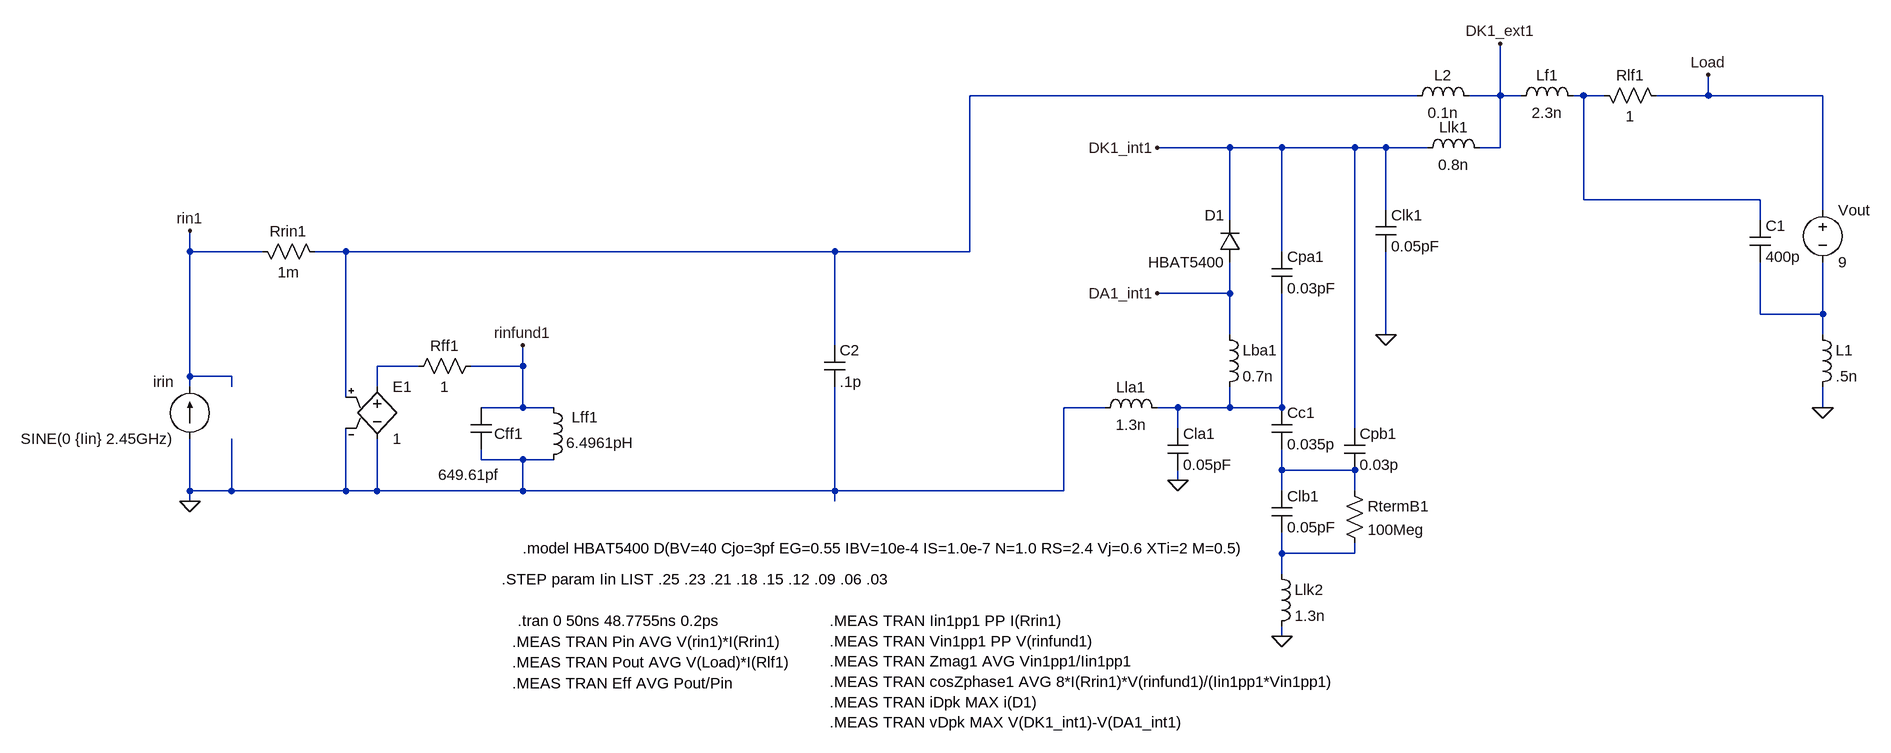
[diagram p0: schematic ResonantRectifier3_HBAT540B_v1.asc]
ResonantRectifier3_HBAT540B_v1.asc, the LTspice schematic file:
Version 4
SHEET 1 2084 796
WIRE 1328 -256 640 -256
WIRE 1456 -256 1456 -336
WIRE 1456 -256 1408 -256
WIRE 1488 -256 1456 -256
WIRE 1584 -256 1568 -256
WIRE 1616 -256 1584 -256
WIRE 1776 -256 1776 -288
WIRE 1776 -256 1696 -256
WIRE 1952 -256 1776 -256
WIRE 1040 -176 928 -176
WIRE 1120 -176 1040 -176
WIRE 1232 -176 1120 -176
WIRE 1280 -176 1232 -176
WIRE 1344 -176 1280 -176
WIRE 1456 -176 1456 -256
WIRE 1456 -176 1424 -176
WIRE 1584 -96 1584 -256
WIRE 1856 -96 1584 -96
WIRE 1280 -80 1280 -176
WIRE 1952 -80 1952 -256
WIRE 1040 -64 1040 -176
WIRE 1856 -64 1856 -96
WIRE -560 -16 -560 -48
WIRE -448 -16 -560 -16
WIRE -320 -16 -368 -16
WIRE 432 -16 -320 -16
WIRE 640 -16 640 -256
WIRE 640 -16 432 -16
WIRE 1120 -16 1120 -176
WIRE 1040 48 1040 0
WIRE 1040 48 928 48
WIRE 1856 80 1856 0
WIRE 1952 80 1952 0
WIRE 1952 80 1856 80
WIRE 1040 112 1040 48
WIRE 1280 112 1280 -16
WIRE 1952 112 1952 80
WIRE 432 128 432 -16
WIRE -208 160 -272 160
WIRE -48 160 -48 128
WIRE -48 160 -128 160
WIRE -560 176 -560 -16
WIRE -496 176 -560 176
WIRE -560 192 -560 176
WIRE -496 192 -496 176
WIRE -272 192 -272 160
WIRE -320 208 -320 -16
WIRE -48 224 -48 160
WIRE -48 224 -112 224
WIRE 0 224 -48 224
WIRE 848 224 784 224
WIRE 960 224 928 224
WIRE 1040 224 1040 192
WIRE 1040 224 960 224
WIRE 1120 224 1120 48
WIRE 1120 224 1040 224
WIRE 1952 224 1952 192
WIRE 960 256 960 224
WIRE 1232 256 1232 -176
WIRE -112 304 -112 288
WIRE -48 304 -112 304
WIRE 0 304 -48 304
WIRE 1120 320 1120 288
WIRE 1232 320 1120 320
WIRE 960 336 960 320
WIRE -560 352 -560 272
WIRE -496 352 -496 272
WIRE -496 352 -560 352
WIRE -320 352 -320 256
WIRE -320 352 -496 352
WIRE -272 352 -272 272
WIRE -272 352 -320 352
WIRE -48 352 -48 304
WIRE -48 352 -272 352
WIRE 432 352 432 192
WIRE 432 352 -48 352
WIRE 784 352 784 224
WIRE 784 352 432 352
WIRE 1120 352 1120 320
WIRE 1232 352 1232 320
WIRE -560 368 -560 352
WIRE 432 368 432 352
WIRE 1120 448 1120 416
WIRE 1232 448 1232 432
WIRE 1232 448 1120 448
WIRE 1120 480 1120 448
WIRE 1120 576 1120 560
FLAG -560 368 0
FLAG 928 -176 DK1_int1
FLAG -560 -48 rin1
FLAG 1776 -288 Load
FLAG -48 128 rinfund1
FLAG 1280 112 0
FLAG 960 336 0
FLAG 1120 576 0
FLAG 928 48 DA1_int1
FLAG 1456 -336 DK1_ext1
FLAG 1952 224 0
SYMBOL cap 1104 -16 R0
SYMATTR InstName Cpa1
SYMATTR Value 0.03pF
SYMBOL cap 1264 -80 R0
SYMATTR InstName Clk1
SYMATTR Value 0.05pF
SYMBOL ind 1472 -240 R270
WINDOW 0 32 56 VTop 2
WINDOW 3 5 56 VBottom 2
SYMATTR InstName Lf1
SYMATTR Value 2.3n
SYMBOL res 1600 -272 M90
WINDOW 0 0 56 VBottom 2
WINDOW 3 32 56 VTop 2
SYMATTR InstName Rlf1
SYMATTR Value 1
SYMBOL cap -128 224 R0
WINDOW 0 36 40 Left 2
WINDOW 3 -50 103 Left 2
SYMATTR InstName Cff1
SYMATTR Value 649.61pf
SYMBOL ind -16 208 R0
WINDOW 0 43 31 Left 2
WINDOW 3 35 70 Left 2
SYMATTR InstName Lff1
SYMATTR Value 6.4961pH
SYMBOL e -272 176 R0
SYMATTR InstName E1
SYMATTR Value 1
SYMBOL current -560 272 R180
WINDOW 0 24 88 Left 2
WINDOW 3 24 0 Left 2
WINDOW 123 0 0 Left 2
WINDOW 39 0 0 Left 2
SYMATTR InstName irin
SYMATTR Value SINE(0 {Iin} 2.45GHz)
SYMBOL res -112 144 R90
WINDOW 0 0 56 VBottom 2
WINDOW 3 32 56 VTop 2
SYMATTR InstName Rff1
SYMATTR Value 1
SYMBOL voltage 1952 -96 R0
WINDOW 123 0 0 Left 2
WINDOW 39 0 0 Left 2
SYMATTR InstName Vout
SYMATTR Value 9
SYMBOL res -464 -32 M90
WINDOW 0 0 56 VBottom 2
WINDOW 3 32 56 VTop 2
SYMATTR InstName Rrin1
SYMATTR Value 1m
SYMBOL diode 1056 0 R180
WINDOW 0 24 72 Left 2
WINDOW 3 24 0 Left 2
SYMATTR InstName D1
SYMATTR Value HBAT5400
SYMBOL ind 1024 96 R0
SYMATTR InstName Lba1
SYMATTR Value 0.7n
SYMBOL ind 1328 -160 R270
WINDOW 0 32 56 VTop 2
WINDOW 3 5 56 VBottom 2
SYMATTR InstName Llk1
SYMATTR Value 0.8n
SYMBOL cap 944 256 R0
SYMATTR InstName Cla1
SYMATTR Value 0.05pF
SYMBOL cap 1104 224 R0
SYMATTR InstName Cc1
SYMATTR Value 0.035p
SYMBOL cap 1104 352 R0
SYMATTR InstName Clb1
SYMATTR Value 0.05pF
SYMBOL cap 1216 256 R0
SYMATTR InstName Cpb1
SYMATTR Value 0.03p
SYMBOL ind 832 240 R270
WINDOW 0 32 56 VTop 2
WINDOW 3 5 56 VBottom 2
SYMATTR InstName Lla1
SYMATTR Value 1.3n
SYMBOL res 1216 336 R0
SYMATTR InstName RtermB1
SYMATTR Value 100Meg
SYMBOL ind 1104 464 R0
SYMATTR InstName Llk2
SYMATTR Value 1.3n
SYMBOL cap 1840 -64 R0
SYMATTR InstName C1
SYMATTR Value 400p
SYMBOL ind 1936 96 R0
SYMATTR InstName L1
SYMATTR Value .5n
SYMBOL ind 1312 -240 R270
WINDOW 0 32 56 VTop 2
WINDOW 3 5 56 VBottom 2
SYMATTR InstName L2
SYMATTR Value 0.1n
SYMBOL cap 416 128 R0
SYMATTR InstName C2
SYMATTR Value .1p
TEXT -48 440 Left 2 !.model HBAT5400 D(BV=40 Cjo=3pf EG=0.55 IBV=10e-4 IS=1.0e-7 N=1.0 RS=2.4 Vj=0.6 XTi=2 M=0.5)
TEXT -56 552 Left 2 !.tran 0 50ns 48.7755ns 0.2ps
TEXT -64 584 Left 2 !.MEAS TRAN Pin AVG V(rin1)*I(Rrin1)
TEXT -64 616 Left 2 !.MEAS TRAN Pout AVG V(Load)*I(Rlf1)
TEXT -64 648 Left 2 !.MEAS TRAN Eff AVG Pout/Pin
TEXT 424 552 Left 2 !.MEAS TRAN Iin1pp1 PP I(Rrin1)\n.MEAS TRAN Vin1pp1 PP V(rinfund1)\n.MEAS TRAN Zmag1 AVG Vin1pp1/Iin1pp1\n.MEAS TRAN cosZphase1 AVG 8*I(Rrin1)*V(rinfund1)/(Iin1pp1*Vin1pp1)\n.MEAS TRAN iDpk MAX i(D1)\n.MEAS TRAN vDpk MAX V(DK1_int1)-V(DA1_int1)
TEXT -80 488 Left 2 !.STEP param Iin LIST .25 .23 .21 .18 .15 .12 .09 .06 .03

The netlist it stands for:
* ResonantRectifier3_HBAT540B_v1.asc
Cpa1 DK1_int1 N005 0.03pF
Clk1 DK1_int1 0 0.05pF
Lf1 DK1_ext1 N002 2.3n
Rlf1 N002 Load 1
Cff1 rinfund1 0 649.61pf
Lff1 rinfund1 0 6.4961pH
E1 N004 0 N001 0 1
irin 0 rin1 SINE(0 {Iin} 2.45GHz)
Rff1 rinfund1 N004 1
Vout Load N003 9
Rrin1 rin1 N001 1m
D1 DA1_int1 DK1_int1 HBAT5400
Lba1 DA1_int1 N005 0.7n
Llk1 DK1_int1 DK1_ext1 0.8n
Cla1 N005 0 0.05pF
Cc1 N005 N006 0.035p
Clb1 N006 N007 0.05pF
Cpb1 DK1_int1 N006 0.03p
Lla1 0 N005 1.3n
RtermB1 N006 N007 100Meg
Llk2 N007 0 1.3n
C1 N002 N003 400p
L1 N003 0 .5n
L2 N001 DK1_ext1 0.1n
C2 N001 0 .1p
.model D D
.lib standard.dio
.model HBAT5400 D(BV=40 Cjo=3pf EG=0.55 IBV=10e-4 IS=1.0e-7 N=1.0 RS=2.4 Vj=0.6 XTi=2 M=0.5)
.tran 0 50ns 48.7755ns 0.2ps
.MEAS TRAN Pin AVG V(rin1)*I(Rrin1)
.MEAS TRAN Pout AVG V(Load)*I(Rlf1)
.MEAS TRAN Eff AVG Pout/Pin
.MEAS TRAN Iin1pp1 PP I(Rrin1)
.MEAS TRAN Vin1pp1 PP V(rinfund1)
.MEAS TRAN Zmag1 AVG Vin1pp1/Iin1pp1
.MEAS TRAN cosZphase1 AVG 8*I(Rrin1)*V(rinfund1)/(Iin1pp1*Vin1pp1)
.MEAS TRAN iDpk MAX i(D1)
.MEAS TRAN vDpk MAX V(DK1_int1)-V(DA1_int1)
.STEP param Iin LIST .25 .23 .21 .18 .15 .12 .09 .06 .03
.backanno
.end